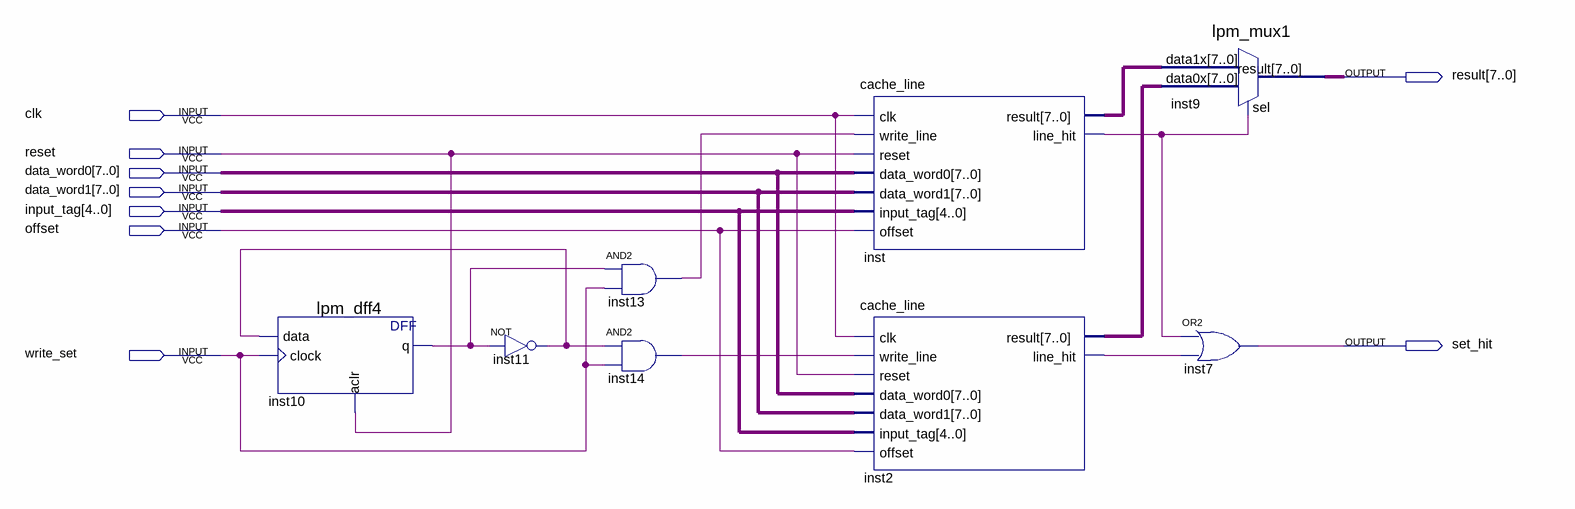
[diagram p0: schematic sheet]
// Quartus schematic cache_final.bdf as structural Verilog: 8 symbols, 9 pins
module cache_final (
  input  clk,
  input  reset,
  input  [7:0] data_word0,
  input  [7:0] data_word1,
  input  [4:0] input_tag,
  input  offset,
  input  write_set,
  output [7:0] result,
  output set_hit
);

  wire inst2_line_hit, inst10_q, inst11_out, inst13_out, inst14_out, inst_line_hit;
  wire [7:0] inst2_result, inst_result;

  lpm_dff4 inst10 (.data(inst11_out), .clock(write_set), .aclr(reset), .q(inst10_q));
  not inst11 (inst11_out, inst10_q);
  and inst13 (inst13_out, inst10_q, write_set);
  and inst14 (inst14_out, inst11_out, write_set);
  cache_line inst (
    .clk(clk), .write_line(inst13_out), .reset(reset), .data_word0(data_word0), .data_word1(data_word1),
    .input_tag(input_tag), .offset(offset), .result(inst_result), .line_hit(inst_line_hit));
  cache_line inst2 (
    .clk(clk), .write_line(inst14_out), .reset(reset), .data_word0(data_word0), .data_word1(data_word1),
    .input_tag(input_tag), .offset(offset), .result(inst2_result), .line_hit(inst2_line_hit));
  lpm_mux1 inst9 (.data1x(inst_result), .data0x(inst2_result), .sel(inst_line_hit), .result(result));
  or inst7 (set_hit, inst_line_hit, inst2_line_hit);
endmodule
